# EasyEDA schematic SCH_Arduino-Train-v.2_2026-08-09.json
TITLE: Arduino Train; REV: 2.01; Date: 2026-08-09; Sheet: 1/1; Drawn By: @avatorl
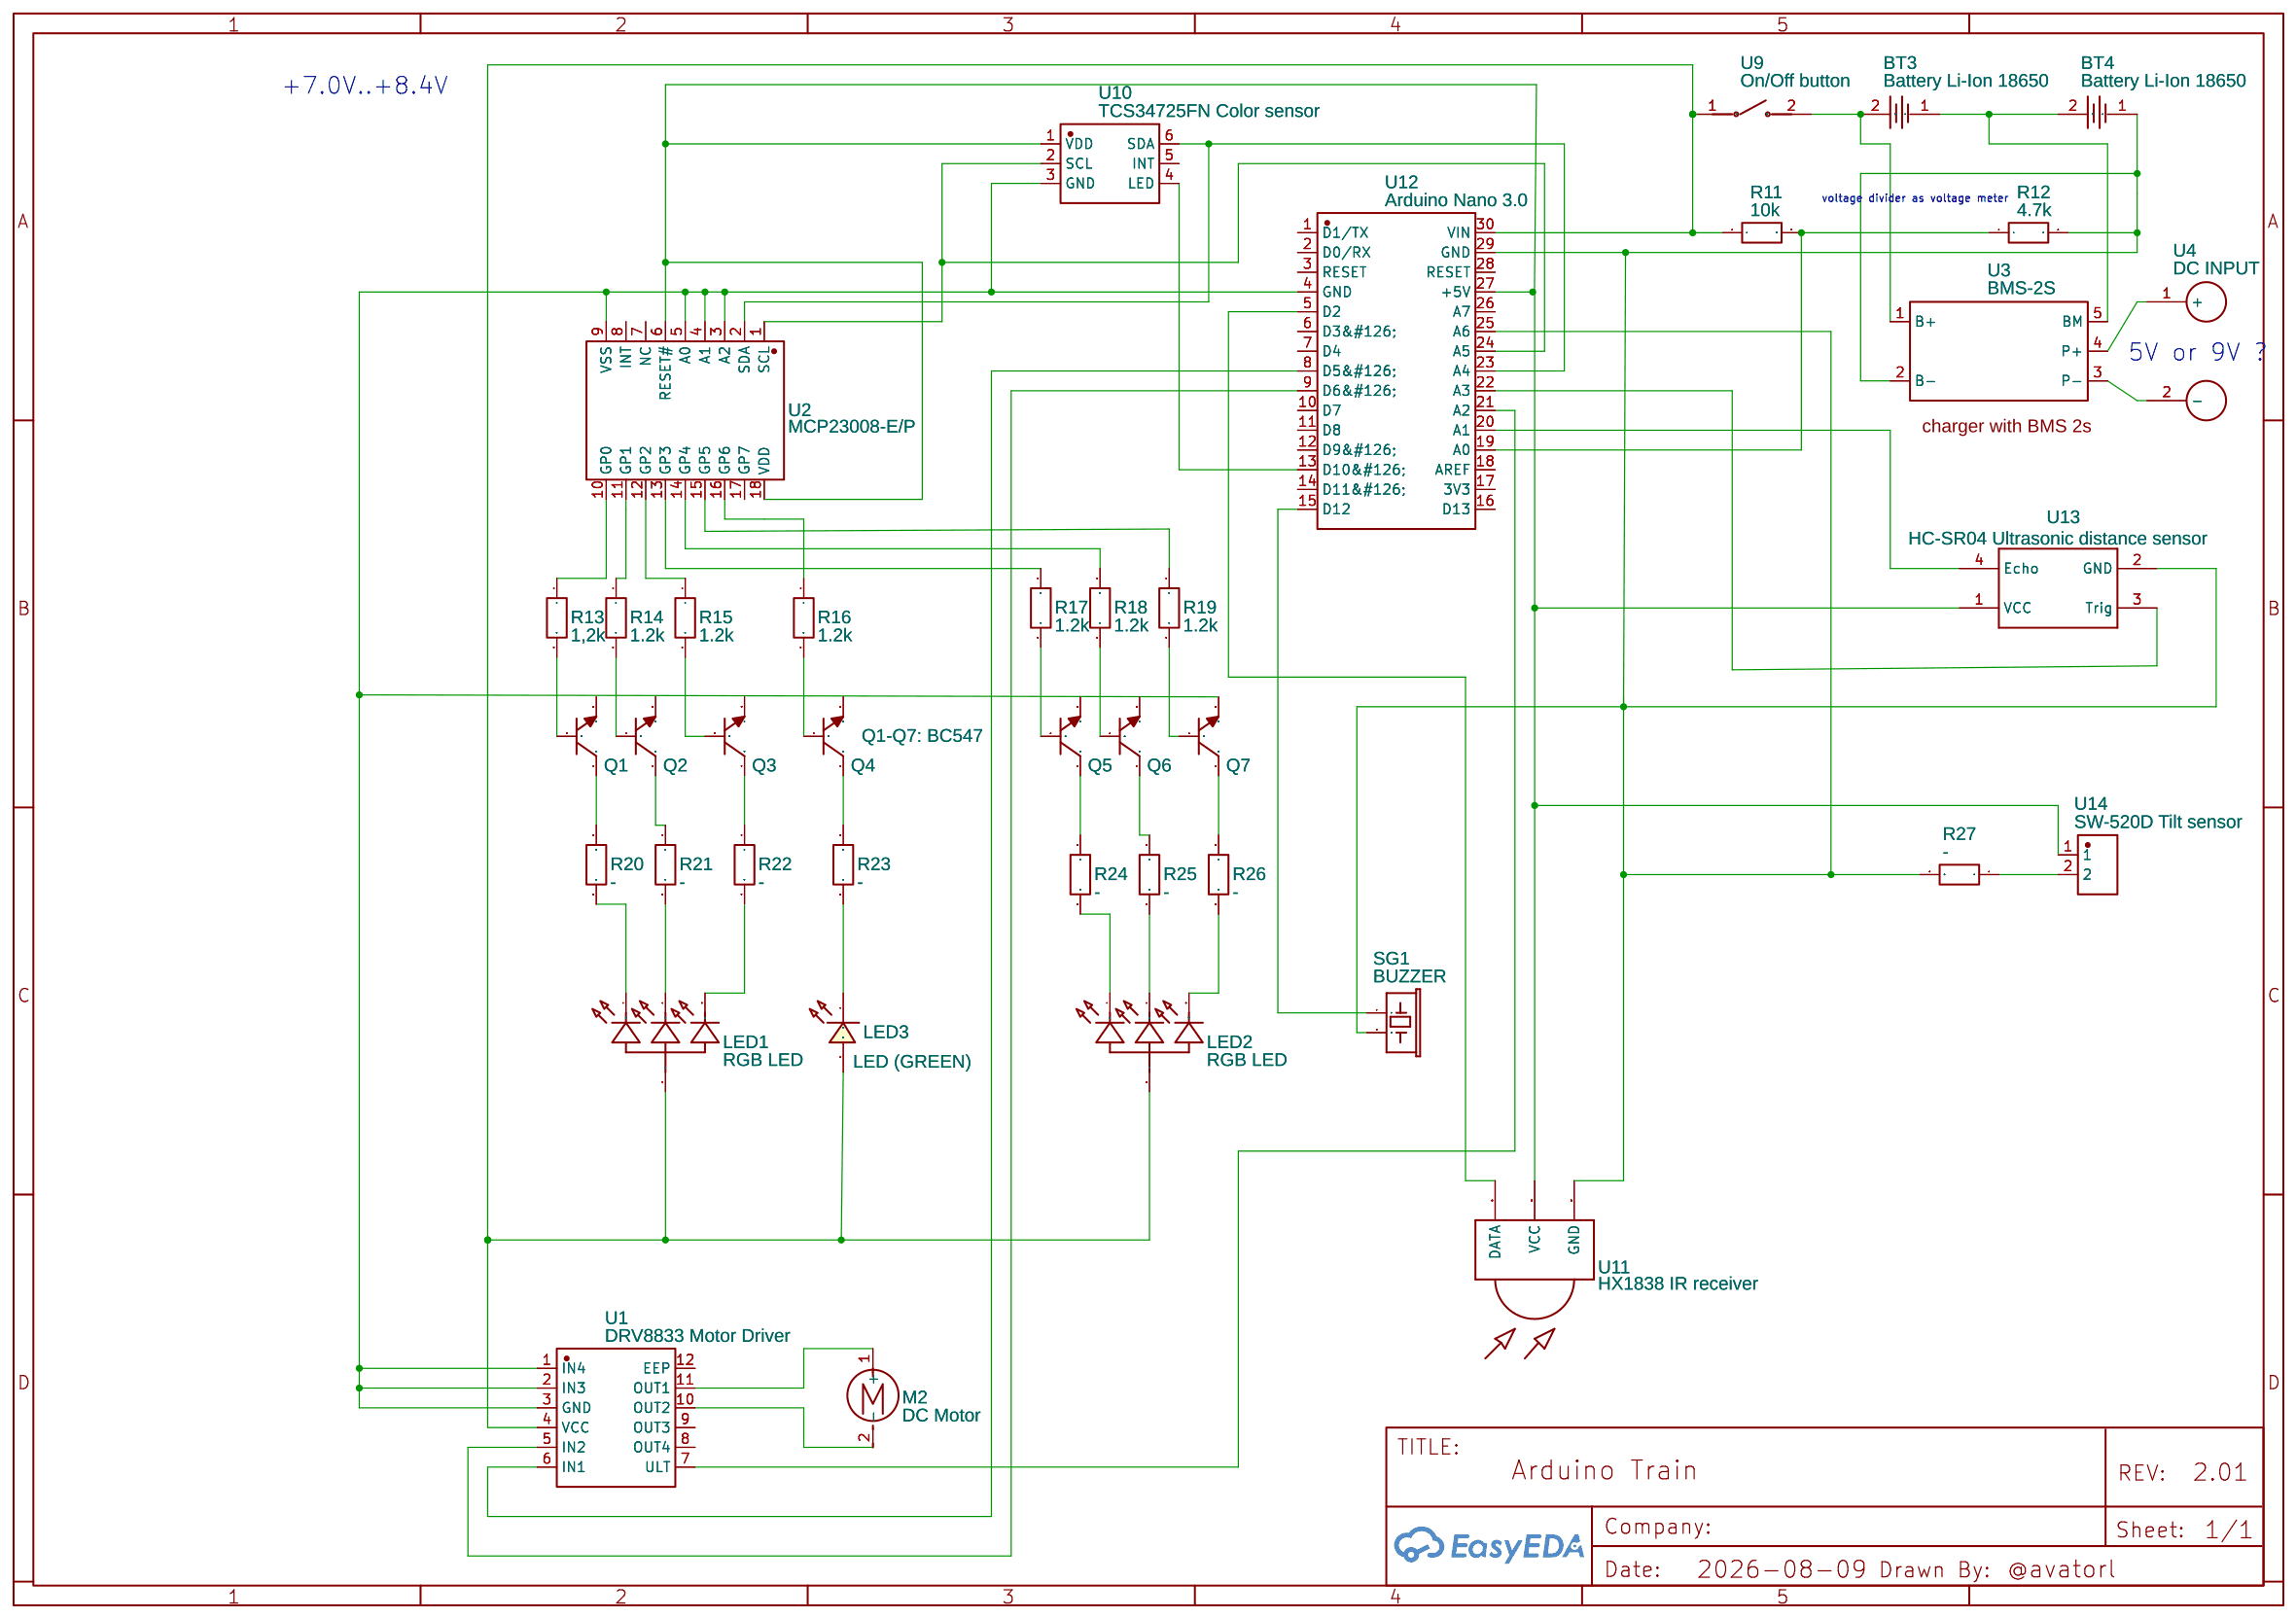
[diagram p0: schematic sheet]

## Parts
BT3  Battery Li-Ion 18650  [BATTERY-SMD_18650-1S-L77.1-W20.7-1]
BT4  Battery Li-Ion 18650  [BATTERY-SMD_18650-1S-L77.1-W20.7-1]
LED1  RGB LED  [LED-SMD_4P-L3.5-W2.8_3528RGB-6028RGB]
LED2  RGB LED  [LED-SMD_4P-L3.5-W2.8_3528RGB-6028RGB]
LED3  LED (GREEN)  [LED-TH_6P_LED4GREEN]
M2  DC Motor  [CONN-TH_2P-P5.08]
Q1  Q1-Q7: BC547  [TO-92-3_L4.5-W3.5-P1.27-L]
Q2  BC547  [TO-92-3_L4.5-W3.5-P1.27-L]
Q3  BC547  [TO-92-3_L4.5-W3.5-P1.27-L]
Q4  BC547  [TO-92-3_L4.5-W3.5-P1.27-L]
Q5  BC547  [TO-92-3_L4.5-W3.5-P1.27-L]
Q6  BC547  [TO-92-3_L4.5-W3.5-P1.27-L]
Q7  BC547  [TO-92-3_L4.5-W3.5-P1.27-L]
R11  10k  [R0603]
R12  4.7k  [R0603]
R13  1,2k  [R0603]
R14  1.2k  [R0603]
R15  1.2k  [R0603]
R16  1.2k  [R0603]
R17  1.2k  [R0603]
R18  1.2k  [R0603]
R19  1.2k  [R0603]
R20  -  [R0603]
R21  -  [R0603]
R22  -  [R0603]
R23  -  [R0603]
R24  -  [R0603]
R25  -  [R0603]
R26  -  [R0603]
R27  -  [R0603]
SG1  BUZZER  [BUZZER-CMT1102]
U1  DRV8833 Motor Driver  [DRV8833]
U2  MCP23008-E/P  [PDIP-18_L22.5-W6.6-P2.54-LS7.9-BL]
U3  BMS-2S  [2S 3A-10A LITHIUM LI-ION 18650 BATTERY BMS PROTECTION PCB BOARD 7.4V/8.4V]
U4  DC INPUT  [DC INPUT]
U9  On/Off button  [SW-SMD_L3.9-W2.9-LS4.9-L]
U10  TCS34725FN Color sensor  [SENSOR-SMD_TCS34725FN]
U11  HX1838 IR receiver  [IR_HX1838]
U12  Arduino Nano 3.0  [COMM-TH_ARDUINO_NANO]
U13  HC-SR04 Ultrasonic distance sensor  [SPM0204UD5]
U14  SW-520D Tilt sensor  [SENSOR-TH_SW-520D]

## Library data of the parts
BT3 BT4 = BH-18650-B1BA002: Contributor: lcsc; Supplier: LCSC; Supplier Part: C2988620; Manufacturer: MYOUNG(美阳); JLCPCB Part Class: Extended Part
LED1 LED2 = 3528RGB 6028RGB: Contributor: lcsc; Supplier: LCSC; Supplier Part: C9900020542; Manufacturer: null; Manufacturer Part: 3528反贴RGB 6028反贴RGB 缺口蓝色; JLCPCB Part Class: Extended Part
LED3 = LED (GREEN): Supplier: LCSC; Supplier Part: C9900027004; Manufacturer: null; Manufacturer Part: LED三色(Red,Yellow,Green); link: https://atta.szlcsc.comnull; Contributor: boumninaotman7
M2 = Motor_DC: Contributor: KiCAD; license: https://www.gnu.org/licenses/lgpl-2.1.html
Q1-Q7 = BC547: Contributor: LCSC; Supplier: LCSC; Supplier Part: C2910381; Manufacturer: CJ(江苏长电/长晶); Manufacturer Part: BC547(RANGE:420-800); JLCPCB Part Class: Extended Part
R11-R27 = R_0603_EU: Contributor: LCEDA_Lib
SG1 = BUZZER: Contributor: SparkFun
U1 = DRV8833 - Motor Driver: Supplier: Add New Supplier; Contributor: Dalibor Drgon
U2 = MCP23008-E/P: Contributor: LCSC; Supplier: LCSC; Supplier Part: C646745; Manufacturer: MICROCHIP(美国微芯); JLCPCB Part Class: Extended Part
U3 = 2S 3A-10A Lithium Li-ion 18650 Battery BMS Protection PCB Board 7.4v/8.4V: Manufacturer Part: HX-2S-D01; Contributor: pavlo.turkot
U4 = DC INPUT: Contributor: Rilles
U9 = BUTTON: Contributor: lcsc; Supplier: LCSC; Supplier Part: C9900015607; Manufacturer: null; JLCPCB Part Class: Extended Part
U10 = TCS34725FN: Contributor: LCSC; Supplier: LCSC; Supplier Part: C2649487; Manufacturer: ams(艾迈斯半导体); JLCPCB Part Class: Extended Part
U11 = IR_HX1838: Supplier: RS-Online; Contributor: DeepDark
U12 = ARDUINO_NANO: Contributor: lcsc; Supplier: LCSC; Supplier Part: C9900017879; Manufacturer: null; JLCPCB Part Class: Extended Part
U13 = SPM0204UD5SMD: Ultrasonic range sensor; Contributor: SparkFun
U14 = SW-520D: Supplier: LCSC; Supplier Part: C5379904; Manufacturer: SHOU HAN(首韩); JLCPCB Part Class: Extended Part; Contributor: lcsc

## Nets
Net-(BT3-1): BT3.1 BT4.2 U3.5(BM)
Net-(BT3-2): BT3.2 U3.1(B+) U9.2
Net-(BT4-1): BT4.1 R12.2 R27.2 SG1.2 U3.2(B-) U11.GND U12.25(A6) U12.29(GND) U13.2(GND)
Net-(LED1-1): LED1.1(B) R21.2
Net-(LED1-2): LED1.2(R) R22.2
Net-(LED1-3): LED1.3(A) LED2.3(A) LED3.2 R11.1 U1.4(VCC) U9.1 U12.30(VIN)
Net-(LED1-4): LED1.4(G) R20.2
Net-(LED2-1): LED2.1(B) R25.2
Net-(LED2-2): LED2.2(R) R26.2
Net-(LED2-4): LED2.4(G) R24.2
Net-(LED3-1): LED3.1 R23.2
Net-(M2-1): M2.1(+) U1.11(OUT1)
Net-(M2-2): M2.2(-) U1.10(OUT2)
Net-(Q1-1): Q1.1(C) R20.1
Net-(Q1-2): Q1.2(B) R13.2
Net-(Q2-1): Q2.1(C) R21.1
Net-(Q2-2): Q2.2(B) R14.2
Net-(Q3-1): Q3.1(C) R22.1
Net-(Q3-2): Q3.2(B) R15.2
Net-(Q4-1): Q4.1(C) R23.1
Net-(Q4-2): Q4.2(B) R16.2
Net-(Q5-1): Q5.1(C) R24.1
Net-(Q5-2): Q5.2(B) R17.2
Net-(Q6-1): Q6.1(C) R25.1
Net-(Q6-2): Q6.2(B) R18.2
Net-(Q7-1): Q7.1(C) R26.1
Net-(Q7-2): Q7.2(B) R19.2
Net-(Q7-3): Q7.3(E) U1.1(IN4) U1.2(IN3) U1.3(GND) U2.3(A2) U2.4(A1) U2.5(A0) U2.9(VSS) U10.3(GND) U12.4(GND)
Net-(R11-2): R11.2 R12.1 U12.19(A0)
Net-(R13-1): R13.1 U2.10(GP0)
Net-(R14-1): R14.1 U2.11(GP1)
Net-(R15-1): R15.1 U2.12(GP2)
Net-(R16-1): R16.1 U2.16(GP6)
Net-(R17-1): R17.1 U2.13(GP3)
Net-(R18-1): R18.1 U2.14(GP4)
Net-(R19-1): R19.1 U2.15(GP5)
Net-(R27-1): R27.1 U14.2
Net-(SG1-1): SG1.1 U12.15(D12)
Net-(U1-5): U1.5(IN2) U12.9(D6&#126;)
Net-(U1-6): U1.6(IN1) U12.8(D5&#126;)
Net-(U1-7): U1.7(ULT) U12.21(A2)
Net-(U2-1): U2.1(SCL) U10.2(SCL) U12.24(A5)
Net-(U2-2): U2.2(SDA) U10.6(SDA) U12.23(A4)
Net-(U2-6): U2.6(RESET#) U2.18(VDD) U10.1(VDD) U11.VCC U12.27(+5V) U13.1(VCC) U14.1
Net-(U3-3): U3.3(P-) U4.2(-)
Net-(U3-4): U3.4(P+) U4.1(+)
Net-(U10-4): U10.4(LED) U12.13(D10&#126;)
Net-(U11-DATA): U11.DATA U12.5(D2)
Net-(U12-20): U12.20(A1) U13.4(Echo)
Net-(U12-22): U12.22(A3) U13.3(Trig)

Not connected (* = marked no-connect by the designer): Q1 3(E); Q2 3(E); Q3 3(E); Q4 3(E); Q5 3(E); Q6 3(E); U1 8(OUT4) 9(OUT3) 12(EEP); U2 7(NC) 8(INT) 17(GP7); U10 5(INT); U12 1(D1/TX) 2(D0/RX) 3(RESET) 6(D3&#126;) 7(D4) 10(D7) 11(D8) 12(D9&#126;) 14(D11&#126;) 16(D13) 17(3V3) 18(AREF) 26(A7) 28(RESET)

## Notes on the sheet
- +7.0V..+8.4V
- voltage divider as voltage meter
- 5V or 9V ?
